# EasyEDA Pro project 电流检测模块.eprj

# Schematic Schematic1
Create Date: 2024-07-30; Page Name: P1; Project Name: 电流检测模块; Schematic Name: Schematic1; Update Date: 2024-07-30; Company: 嘉立创EDA; Page Size: A4; Version: V1.0
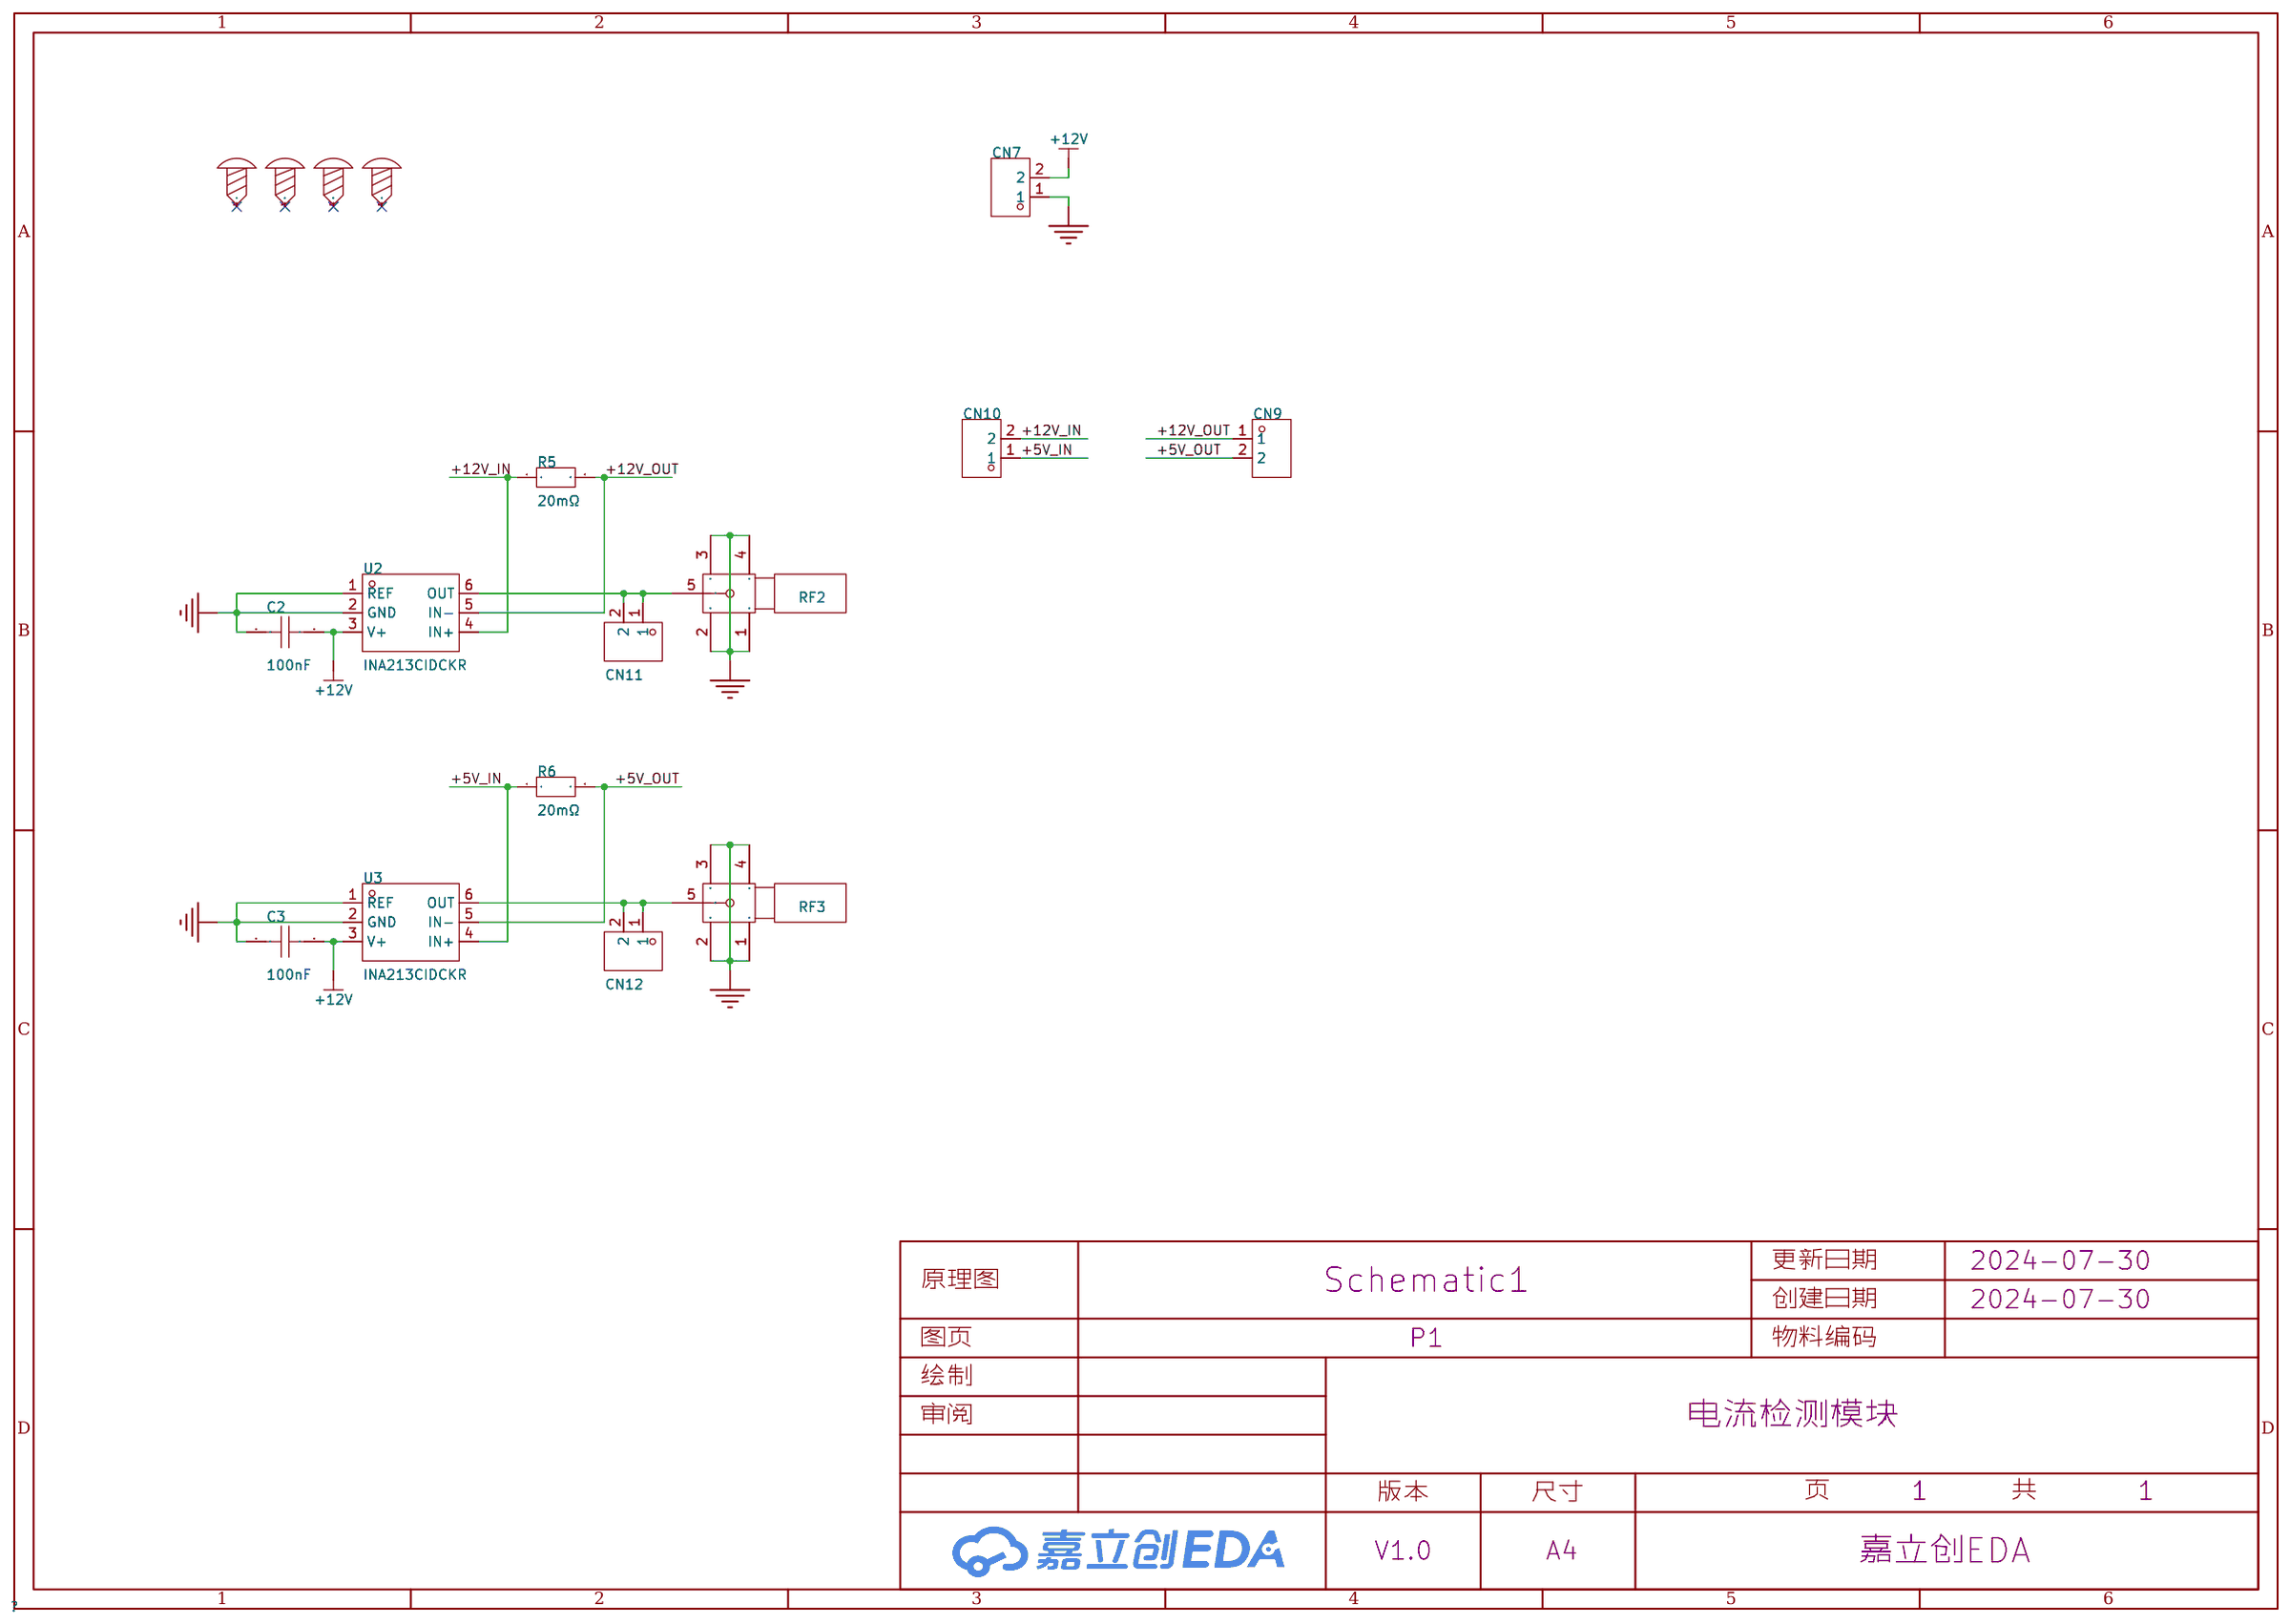
[diagram p0: schematic sheet]

## Parts
C2  100nF  [C0603]
C3  100nF  [C0603]
CN7  DB2ERC-5.08-2P-GN  [CONN-TH_2P-P5.08_DB2ERC-5.08-2P]
CN9  DB2ERC-5.08-2P-GN  [CONN-TH_2P-P5.08_DB2ERC-5.08-2P]
CN10  DB2ERC-5.08-2P-GN  [CONN-TH_2P-P5.08_DB2ERC-5.08-2P]
CN11  DB2EVC-3.81-2P-GN  [CONN-TH_2P-P3.81_DB2EVC-3.81-2P-BK]
CN12  DB2EVC-3.81-2P-GN  [CONN-TH_2P-P3.81_DB2EVC-3.81-2P-BK]
R5  20mΩ  [R2512]
R6  20mΩ  [R2512]
RF2  BWSMA-KE-Z001  [SMA-TH_BWSMA-KE-Z001]
RF3  BWSMA-KE-Z001  [SMA-TH_BWSMA-KE-Z001]
TP1  -  [M3螺丝]
TP2  -  [M3螺丝]
TP3  -  [M3螺丝]
TP4  -  [M3螺丝]
U2  INA213CIDCKR  [SC70-6_L2.0-W1.3-P0.65-LS2.1-BL]
U3  INA213CIDCKR  [SC70-6_L2.0-W1.3-P0.65-LS2.1-BL]

## Library data of the parts
C2 C3 = CAP_0603: Supplier Footprint: 0603
CN7 CN9 CN10 = DB2ERC-5.08-2P-GN: 连接器类型:板端/插座-闭口;结构:1x2P;间距:5.08mm;颜色:绿色;安装方式:弯针;排数:1;每排PIN数:2;额定电流:20A;额定电压:320V;工作温度范围:-40℃~+105℃;; LCSC Part Name: 5.08mm 1x2P 排数:1 每排P数:2; Supplier Part: C395737; Manufacturer: DORABO(地博电气); Supplier Footprint: 弯插,P=5.08mm; JLCPCB Part Class: 扩展库; Datasheet: https://atta.szlcsc.com/upload/public/pdf/source/20230327/49BCB2D820551F12B61E36BBA9DDD5A2.pdf; Supplier: LCSC; Connector Type: 板端/插座-闭口; Structure: 1x2P; Pitch: 5.08mm; Color: 绿色; Mounting Style: 弯针; Number of Pins: 2P; Number of Rows: 1; Number of PINs Per Row: 2; Current Rating (Max): 20A; Voltage Rating (Max): 320V; Operating Temperature Range: -40℃~+105℃
CN11 CN12 = DB2EVC-3.81-2P-GN: 连接器类型:板端/插座-闭口;结构:1x2P;间距:3.81mm;颜色:绿色;安装方式:直针;排数:1;每排PIN数:2;额定电流:10A;额定电压:250V;工作温度范围:-40℃~+105℃;; LCSC Part Name: 3.81mm 1x2P 排数:1 每排P数:2; Supplier Part: C395686; Manufacturer: DORABO(地博电气); Supplier Footprint: 插件,P=3.81mm; JLCPCB Part Class: 扩展库; Datasheet: https://atta.szlcsc.com/upload/public/pdf/source/20230106/E295F87ABDAA44E449E4D4A582259339.pdf; Supplier: LCSC; Connector Type: 板端/插座-闭口; Structure: 1x2P; Pitch: 3.81mm; Color: 绿色; Mounting Style: 直针; Number of Pins: 2P; Number of Rows: 1; Number of PINs Per Row: 2; Current Rating (Max): 10A; Voltage Rating (Max): 250V; Operating Temperature Range: -40℃~+105℃
R5 R6 = HoGT2512-3W-20mR-1%: 电阻类型:采样电阻;阻值:20mΩ;精度:±1%;功率:3W;温度系数:±100ppm/℃;安装方式:贴片;; LCSC Part Name: 20mΩ ±1% 3W; Supplier Part: C841783; Manufacturer: Milliohm(毫欧); Supplier Footprint: 2512; JLCPCB Part Class: 扩展库; Datasheet: https://atta.szlcsc.com/upload/public/pdf/source/20230904/E9D6DE20D7B67D5CA466D462966750AA.pdf; Supplier: LCSC; Type: 采样电阻; Tolerance: ±1%; Power(Watts): 3W; Temperature Coefficient: ±100ppm/℃; Mounting Sytle: 贴片
RF2 RF3 = BWSMA-KE-Z001_C496549: 连接器类型:板端;接口类型:内孔;端口数量:1;接口直径:-;接口长度/高度:-;频率-最大值:-;射频系列:SMA;阻抗:50Ω;样式:正脚;触头材质:-;触头镀层:-;工作温度范围:-65℃~+165℃;焊接温度(最大值):-;; LCSC Part Name: 内孔 SMA 正脚; Supplier Part: C496549; Manufacturer: BAT WIRELESS(蝙蝠无线); Supplier Footprint: 插件; JLCPCB Part Class: Extended Part; Datasheet: https://atta.szlcsc.com/upload/public/pdf/source/20221228/40BF41E56A06003A0210E1785CA66EA6.pdf; Supplier: LCSC; Connector Type: 板端; Interface Type: 内孔; Number of Ports: 1; RF Series: SMA; Impedance: 50Ω; Style: 正脚; Operating Temperature Range: -65℃~+165℃
TP1-TP4 = M3螺丝: Supplier Footprint: 插件
U2 U3 = INA213CIDCKR: 放大器数:单路;; Supplier Part: C2878840; Manufacturer: TI(德州仪器); Supplier Footprint: SC-70-6; JLCPCB Part Class: 扩展库; Datasheet: https://www.ti.com/cn/lit/gpn/ina213; Supplier: LCSC; Number of Channels: 单路; Supply Current: 65uA; Operating Temperature: -40℃~+125℃

## Nets
+5V_IN: CN10.1 R6.1 U3.4(IN+)
+5V_OUT: CN9.2 R6.2 U3.5(IN-)
+12V: C2.2 C3.2 CN7.2 U2.3(V+) U3.3(V+)
+12V_IN: CN10.2 R5.1 U2.4(IN+)
+12V_OUT: CN9.1 R5.2 U2.5(IN-)
GND: C2.1 C3.1 CN7.1 RF2.1 RF2.2 RF2.3 RF2.4 RF3.1 RF3.2 RF3.3 RF3.4 U2.1(REF) U2.2(GND) U3.1(REF) U3.2(GND)
$1N1171: CN11.1 CN11.2 RF2.5 U2.6(OUT)
$1N1528: CN12.1 CN12.2 RF3.5 U3.6(OUT)

Not connected (* = marked no-connect by the designer): TP1 1*; TP2 1*; TP3 1*; TP4 1*

# Board PCB1
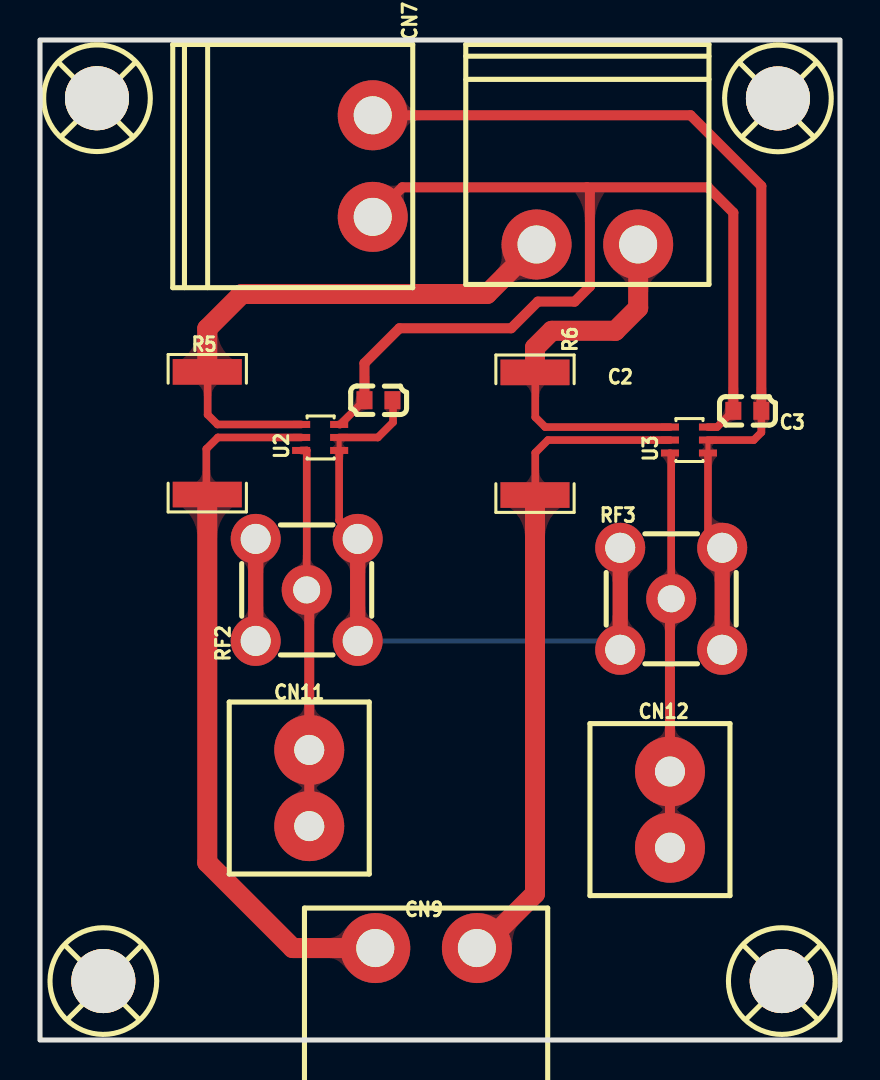
[diagram p1: board, top side]
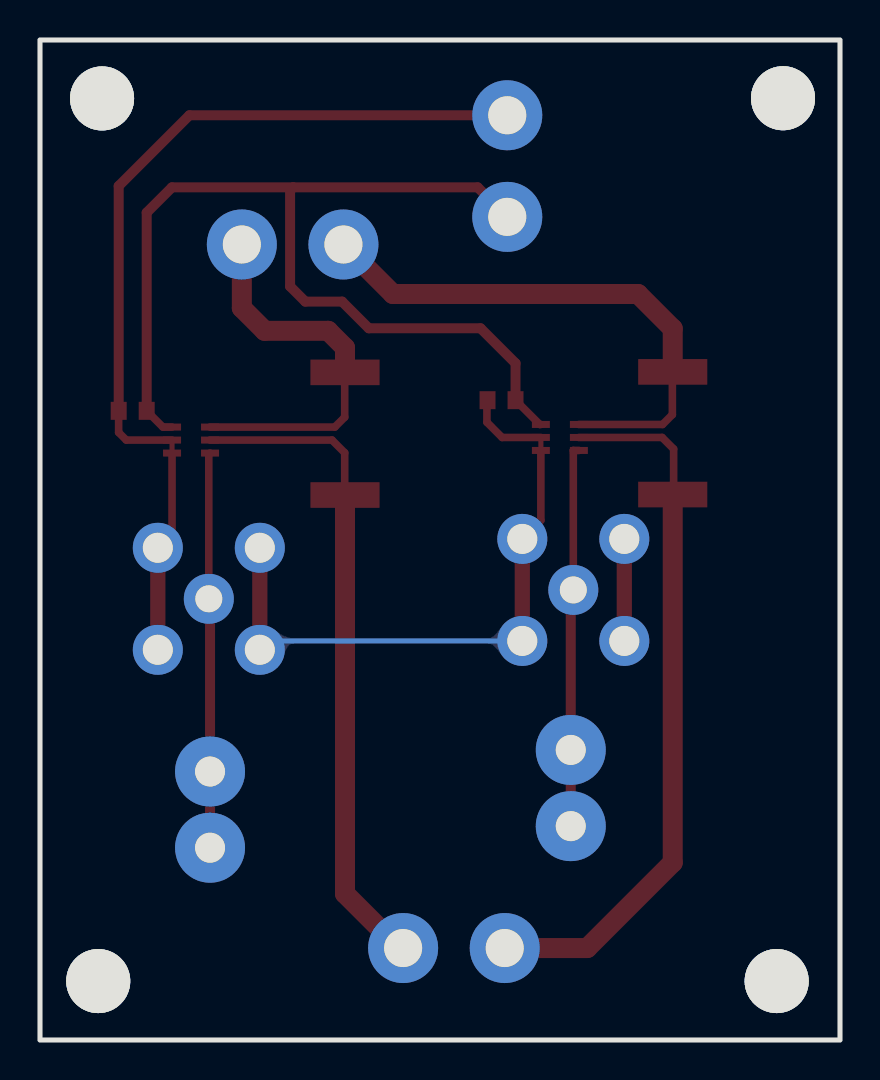
[diagram p2: board, bottom side, seen from below]

Outline 40 x 50 mm; copper layers: Top Layer, Bottom Layer. Coordinates in mm from the lower left corner of the outline.
Outline path: rectangle 0,50 40,0
Stack: Top Layer 0.035mm / Dielectric1 1.51mm FR4 er 4.5 / Bottom Layer 0.035mm

## Design rules (mm)
template: JLCPCB Capability(Two Layers Board)
spacing copperThickness1oz (default): track to track 0.102, other pairs 0.152 to 0.3
spacing copperThickness2oz: track to track 0.203, other pairs 0.152 to 0.3
track width copperThickness1oz (default): min 0.127, default 0.254, max 2.54
track width copperThickness2oz: min 0.203, default 0.254, max 2.54
differential pair differentialPair (default): width min 0.127, default 0.254, max 2.54; gap min 0.152, default 0.152
via viaSize (default): diameter min 0.5, default 0.61, max 10; hole min 0.3, default 0.305, max 6.3

## Placement (name value [footprint] x y rotation side)
C2  100nF  [C0603]  16.92 31.99 180 top
C3  100nF  [C0603]  35.37 31.46 180 top
CN7  DB2ERC-5.08-2P-GN  [conn-th_2p-p5.08_db2erc-5.08-2p]  16.64 43.7 270 top
CN9  DB2ERC-5.08-2P-GN  [conn-th_2p-p5.08_db2erc-5.08-2p]  19.3 4.6 0 top
CN10  DB2ERC-5.08-2P-GN  [conn-th_2p-p5.08_db2erc-5.08-2p]  27.37 39.78 180 top
CN11  DB2EVC-3.81-2P-GN  [conn-th_2p-p3.81_db2evc-3.81-2p-bk]  13.46 12.6 270 top
CN12  DB2EVC-3.81-2P-GN  [conn-th_2p-p3.81_db2evc-3.81-2p-bk]  31.5 11.52 270 top
R5  20mΩ  [R2512]  8.36 30.34 270 top
R6  20mΩ  [R2512]  24.75 30.31 270 top
RF2  BWSMA-KE-Z001  [sma-th_bwsma-ke-z001]  13.34 22.5 90 top
RF3  BWSMA-KE-Z001  [sma-th_bwsma-ke-z001]  31.56 22.06 0 top
TP1  -  [M3螺丝]  3.23 2.88 0 top
TP2  -  [M3螺丝]  2.91 47.03 0 top
TP3  -  [M3螺丝]  36.96 47.02 0 top
TP4  -  [M3螺丝]  37.15 2.88 0 top
U2  INA213CIDCKR  [SC70-6_L2.0-W1.3-P0.65-LS2.1-BL]  14.01 30.13 90 top
U3  INA213CIDCKR  [SC70-6_L2.0-W1.3-P0.65-LS2.1-BL]  32.45 30 90 top

## Footprints (pads in the part's own frame, mm; a bottom-side part is the same pattern mirrored in y, then rotated)
C0603
  rect 0.8x0.9 smd: 1(-0.7,0) 2(0.7,0)
conn-th_2p-p3.81_db2evc-3.81-2p-bk
  round 3.5 hole 1.5: 1(-1.905,0) 2(1.905,0)
conn-th_2p-p5.08_db2erc-5.08-2p
  round 3.5 hole 1.9: 1(-2.54,0) 2(2.54,0)
M3螺丝
  round 3.2 hole 3.2: 1(-0.064,0.064)
R2512
  rect 1.282x3.456 smd: 1(-3.067,0) 2(3.067,0)
SC70-6_L2.0-W1.3-P0.65-LS2.1-BL
  rect 0.35x0.9 smd: 1(-0.65,-0.95) 2(0,-0.95) 3(0.65,-0.95) 4(0.65,0.95) 5(0,0.95) 6(-0.65,0.95)
sma-th_bwsma-ke-z001
  round 2.5 hole 1.5: 1(-2.55,-2.55) 2(-2.55,2.55) 3(2.55,2.55) 4(2.55,-2.55)
  round 2.5 hole 1.35: 5(0,0)

## Nets
As in the schematic.

Pads without a net: TP1 1; TP2 1; TP3 1; TP4 1

## Routing (per net, layer and track width the routed paths; a pad name or vN(x,y) marks a point on that pad's centre or on a via; arc(x,y) is an arc through that point)
+5V_IN: length 19.6
  Top Layer w0.381: U3.4 25.26,30.65 24.76,31.14 24.76,33.37 R6.1
  Top Layer w1: R6.1 24.75,34.62 25.59,35.46 28.77,35.46 29.91,36.6 CN10.1
+5V_OUT: length 33.1
  Top Layer w0.381: U3.5 25.4,30 24.76,29.36 24.76,27.26 R6.2
  Top Layer w1: R6.2 24.75,7.31 22.03,4.6 CN9.2
+12V: length 52.2
  Top Layer w0.381: U2.3 15.01,30.78 C2.2 ; C3.2 33.85,30.65 U3.3
  Top Layer w0.5: 27.34,42.63 27.5,42.48 27.5,37.68 26.73,36.92 24.89,36.92 23.56,35.59 17.97,35.59 16.22,33.84 C2.2 ; 27.34,42.63 33.4,42.63 34.67,41.37 C3.2 ; 27.34,42.63 18.11,42.63 CN7.2
+12V_IN: length 27.4
  Top Layer w0.381: 8.36,33.41 8.38,33.39 8.38,31.27 8.87,30.78 U2.4
  Top Layer w1: 8.36,33.41 8.36,35.57 10.1,37.3 22.35,37.3 CN10.2
+12V_OUT: length 35.8
  Top Layer w0.381: R5.2 8.32,27.32 8.32,29.55 8.89,30.13 U2.5
  Top Layer w1: R5.2 8.36,8.87 12.64,4.6 CN9.1
GND: length 85
  Top Layer w0.254: U3.1 U3.2 ; U2.1 U2.2
  Top Layer w0.381: U2.2 16.89,30.13 17.65,30.89 17.65,31.96 C2.1 ; U3.1 33.4,25.32 RF3.3 ; U3.2 35.69,30 36.07,30.38 36.07,31.46 C3.1 ; U2.1 14.96,25.98 15.88,25.05
  Top Layer w0.5: C3.1 36.07,42.7 32.53,46.24 CN7.1
  Top Layer w0.762: RF2.2 RF2.3 ; RF3.4 RF3.3 ; RF3.1 RF3.2 ; 15.88,19.95 15.88,25.05
  Bottom Layer w0.254: 15.88,19.95 28.56,19.95 RF3.1
$1N1171: length 19.1
  Top Layer w0.381: RF2.5 13.34,29.48 U2.6
  Top Layer w0.5: CN11.2 CN11.1 13.46,22.38 RF2.5
$1N1528: length 19.8
  Top Layer w0.381: U3.6 31.56,29.29 RF3.5
  Top Layer w0.5: RF3.5 31.5,22 CN12.1 CN12.2

Small or netless copper shapes (teardrops, artwork), in the pictures only: 49 on Top Layer, 2 on Bottom Layer
